# Altium schematic sheet SCH_SA45_DaughterCard.SchDoc: NOT USED
size B; Date: NOT USED; ApprovedBy: NOT USED; CheckedBy: NOT USED; Author: NOT USED; CompanyName: NOT USED; DrawnBy: NOT USED; Engineer: NOT USED; Organization: NOT USED; Address1: NOT USED; Address2: NOT USED; Address3: NOT USED; Address4: NOT USED; DocumentNumber: Use Project Parameter prjSchematic_IPN; Revision: NOT USED; SheetNumber: 1; SheetTotal: 1; sch_PageDescription: Page Description; sch_PageTitle: Page Title; PageDate: NOT USED; Time: NOT USED; DocumentFullPathAndName: NOT USED; DocumentName: NOT USED; ImagePath: NOT USED; ProjectName: NOT USED; Application_BuildNumber: NOT USED
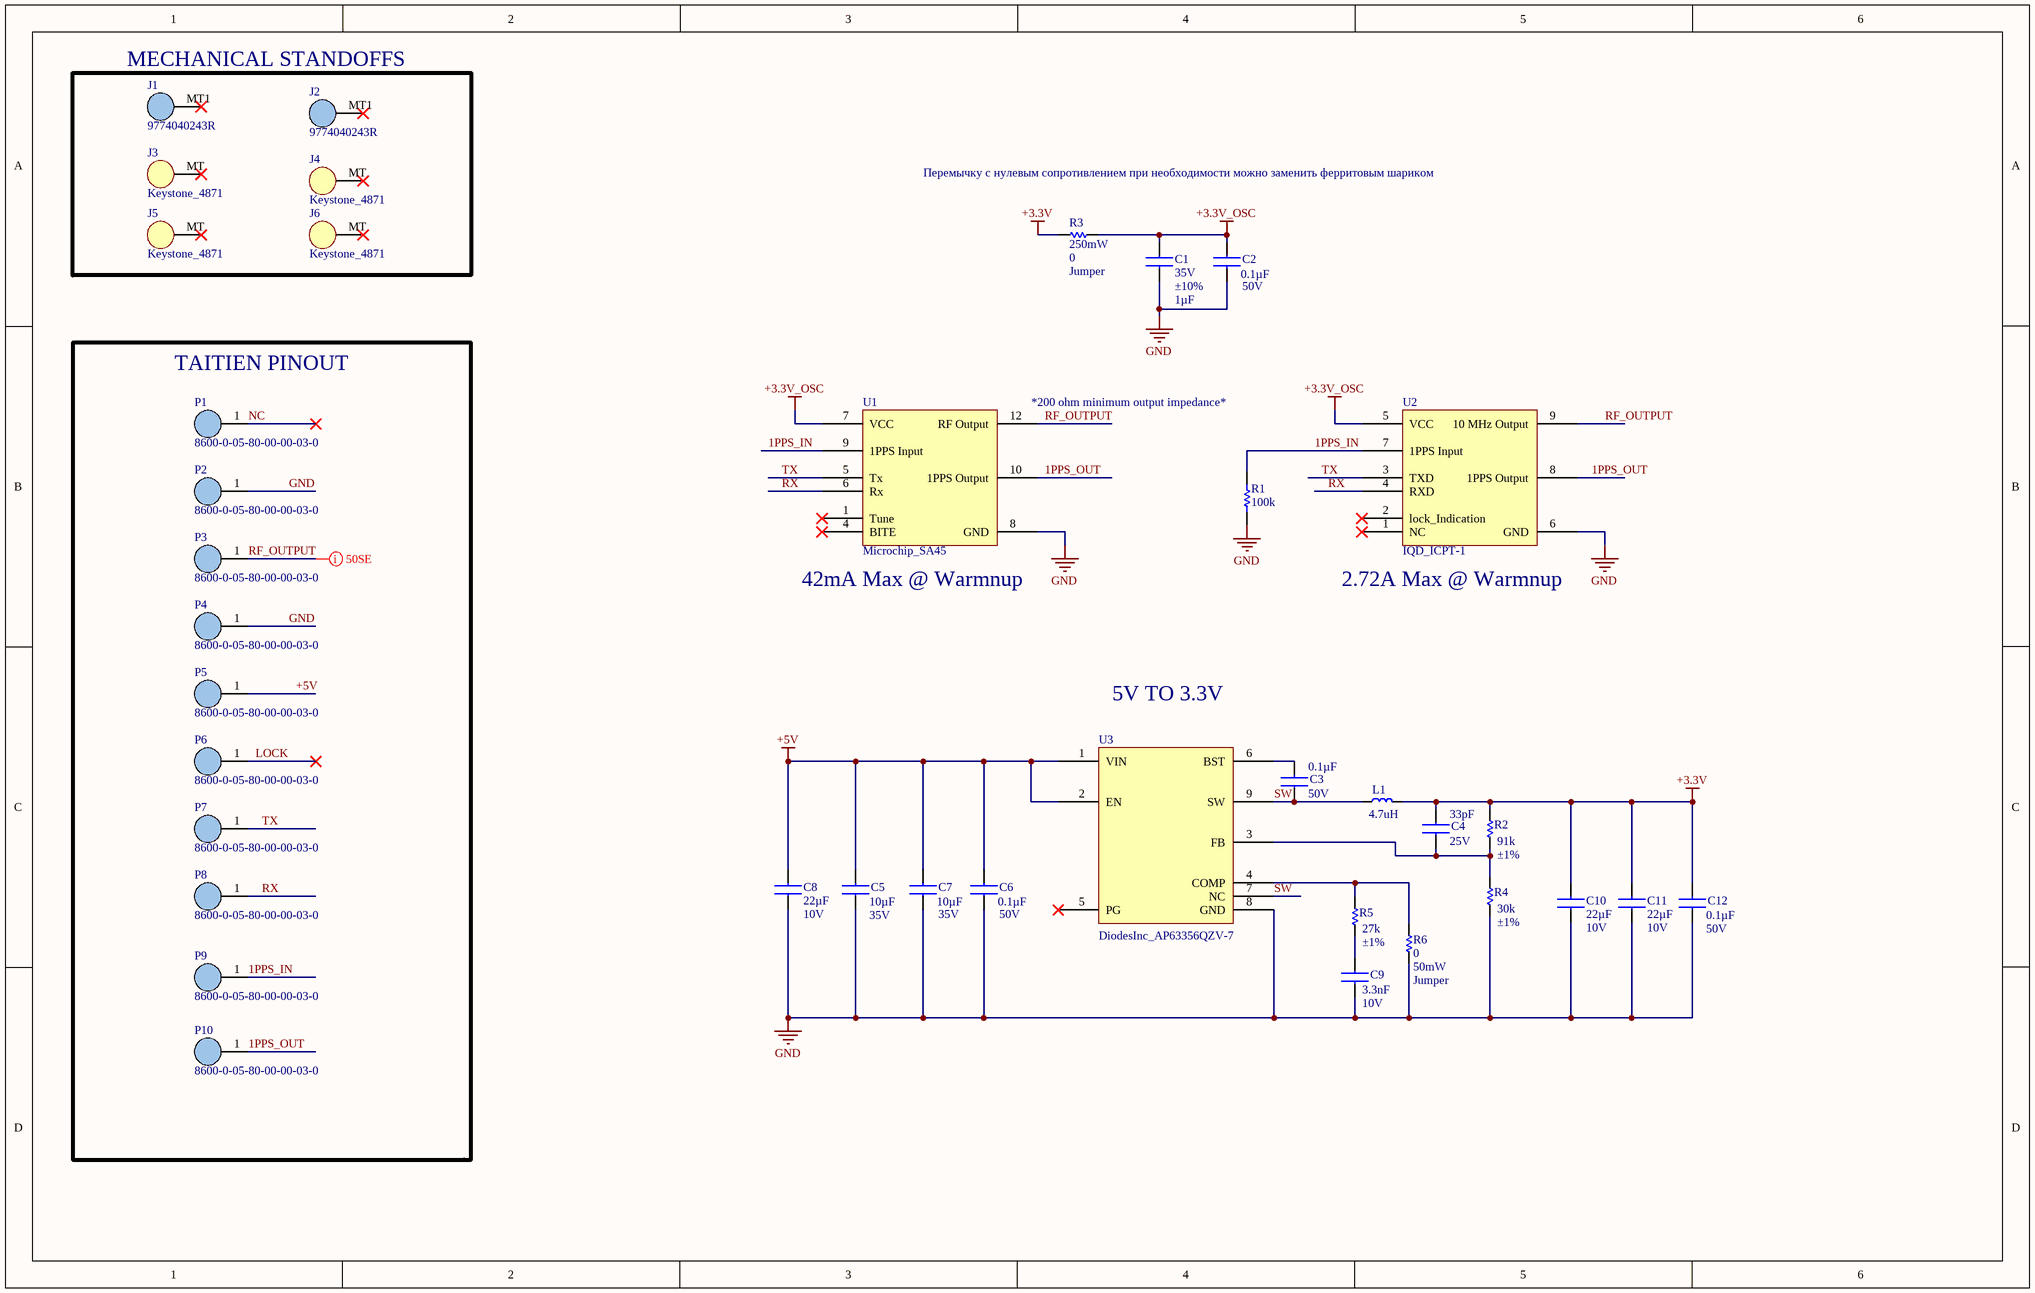
[diagram p0: SCH_SA45_DaughterCard.SchDoc]

## Parts
C1  Voltage Rating: 35V  Tolerance: ±10%  Capacitance: 1µF  [CAPC1005X061N]  (hidden comment: Murata_GRM155R6YA105KE11D)
C2  Voltage Rating: 50V  Capacitance: 0.1µF  [CAPC1005X055N]  (hidden comment: Murata_GRM155R61H104KE14D)
C3  Voltage Rating: 50V  Capacitance: 0.1µF  [CAPC1005X055N]  (hidden comment: Murata_GRM155R61H104KE14D)
C4  Capacitance: 33pF  Voltage Rating: 25V  [CAPC0603X033N]  (hidden comment: Murata_GRM0335C1E330JA01D)
C5  Voltage Rating: 35V  Capacitance: 10µF  [CAPC2013X145N]  (hidden comment: Murata_GRM21BR6YA106KE43L)
C6  Voltage Rating: 50V  Capacitance: 0.1µF  [CAPC1005X055N]  (hidden comment: Murata_GRM155R61H104KE14D)
C7  Voltage Rating: 35V  Capacitance: 10µF  [CAPC2013X145N]  (hidden comment: Murata_GRM21BR6YA106KE43L)
C8  Capacitance: 22µF  Voltage Rating: 10V  [CAPC2013X140N]  (hidden comment: Murata_GRM21BR61A226ME51L)
C9  Capacitance: 3.3nF  Voltage Rating: 10V  [CAPC0603X033N]  (hidden comment: Murata_GRM033R61A332KA01D)
C10  Capacitance: 22µF  Voltage Rating: 10V  [CAPC2013X140N]  (hidden comment: Murata_GRM21BR61A226ME51L)
C11  Capacitance: 22µF  Voltage Rating: 10V  [CAPC2013X140N]  (hidden comment: Murata_GRM21BR61A226ME51L)
C12  Voltage Rating: 50V  Capacitance: 0.1µF  [CAPC1005X055N]  (hidden comment: Murata_GRM155R61H104KE14D)
J1  Manufacturer Part Number: 9774040243R  [TH000V_300DIAx400_001mt_9774040243R]  (hidden comment: Wurth_9774040243R)
J2  Manufacturer Part Number: 9774040243R  [TH000V_300DIAx400_001mt_9774040243R]  (hidden comment: Wurth_9774040243R)
J3  Keystone_4871  [Keystone_4871]
J4  Keystone_4871  [Keystone_4871]
J5  Keystone_4871  [Keystone_4871]
J6  Keystone_4871  [Keystone_4871]
L1  4.7uH  [Eaton_HCM0703-4R7-R]
P1  Manufacturer Part Number: 8600-0-05-80-00-00-03-0  [TH001V_109DIA_000mt_8600-0]  (hidden comment: Mill-Max_8600-0-05-80-00-00-03-0)
P2  Manufacturer Part Number: 8600-0-05-80-00-00-03-0  [TH001V_109DIA_000mt_8600-0]  (hidden comment: Mill-Max_8600-0-05-80-00-00-03-0)
P3  Manufacturer Part Number: 8600-0-05-80-00-00-03-0  [TH001V_109DIA_000mt_8600-0]  (hidden comment: Mill-Max_8600-0-05-80-00-00-03-0)
P4  Manufacturer Part Number: 8600-0-05-80-00-00-03-0  [TH001V_109DIA_000mt_8600-0]  (hidden comment: Mill-Max_8600-0-05-80-00-00-03-0)
P5  Manufacturer Part Number: 8600-0-05-80-00-00-03-0  [TH001V_109DIA_000mt_8600-0]  (hidden comment: Mill-Max_8600-0-05-80-00-00-03-0)
P6  Manufacturer Part Number: 8600-0-05-80-00-00-03-0  [TH001V_109DIA_000mt_8600-0]  (hidden comment: Mill-Max_8600-0-05-80-00-00-03-0)
P7  Manufacturer Part Number: 8600-0-05-80-00-00-03-0  [TH001V_109DIA_000mt_8600-0]  (hidden comment: Mill-Max_8600-0-05-80-00-00-03-0)
P8  Manufacturer Part Number: 8600-0-05-80-00-00-03-0  [TH001V_109DIA_000mt_8600-0]  (hidden comment: Mill-Max_8600-0-05-80-00-00-03-0)
P9  Manufacturer Part Number: 8600-0-05-80-00-00-03-0  [TH001V_109DIA_000mt_8600-0]  (hidden comment: Mill-Max_8600-0-05-80-00-00-03-0)
P10  Manufacturer Part Number: 8600-0-05-80-00-00-03-0  [TH001V_109DIA_000mt_8600-0]  (hidden comment: Mill-Max_8600-0-05-80-00-00-03-0)
R1  100k  [RESC1608X55X30ML15T15]
R2  Tolerance: ±1%  Resistance: 91k  [RESC1005X040N]  (hidden comment: Yageo_RC0402FR-0791KL)
R3  Power (Watts): 250mW  Resistance: 0  Tolerance: Jumper  [RESC3216X070N]  (hidden comment: Yageo_RC1206JR-070RL)
R4  Tolerance: ±1%  Resistance: 30k  [RESC1005X040N]  (hidden comment: Yageo_RC0402FR-0730KL)
R5  Tolerance: ±1%  Resistance: 27k  [RESC1005X040N]  (hidden comment: Panasonic_ERJ-2RKF2702X)
R6  Resistance: 0  Power (Watts): 50mW  Tolerance: Jumper  [RESC0603X026N]  (hidden comment: Yageo_RC0201JR-070RL)
U1  Microchip_SA45  [Microchip_SA45]
U2  IQD_ICPT-1  [IQD_ICPT-1]
U3  DiodesInc_AP63356QZV-7  [DiodesInc_AP63356QZV-7]

## Blocks framed on the sheet
MECHANICAL STANDOFFS: J1-J6
TAITIEN PINOUT: P1-P10

## Nets
+3.3V: C4.1 C10.1 C11.1 C12.1 L1.2 R2.1 R3.1
+3.3V_OSC: C1.1 C2.1 R3.2 U1.7(VCC) U2.5(VCC)
+5V: C5.1 C6.1 C7.1 C8.1 P5.1 U3.1(VIN) U3.2(EN)
GND: C1.2 C2.2 C5.2 C6.2 C7.2 C8.2 C9.2 C10.2 C11.2 C12.2 P2.1 P4.1 R1.1 R4.2 R6.2 U1.8(GND) U2.6(GND) U3.8(GND)
1PPS_IN: P9.1 R1.2 U1.9(1PPS_Input) U2.7(1PPS_Input)
1PPS_OUT: P10.1 U1.10(1PPS_Output) U2.8(1PPS_Output)
LOCK: P6.1
NC: P1.1
RF_OUTPUT: P3.1 U1.12(RF_Output) U2.9(10_MHz_Output)
RX: P8.1 U1.6(Rx) U2.4(RXD)
SW: C3.2 L1.1 U3.7(NC) U3.9(SW)
TX: P7.1 U1.5(Tx) U2.3(TXD)
NetC3_1: C3.1 U3.6(BST)
NetC4_2: C4.2 R2.2 R4.1 U3.3(FB)
NetC9_1: C9.1 R5.2
NetR5_1: R5.1 R6.1 U3.4(COMP)

Not connected (* = marked no-connect by the designer): J1 MT1*; J2 MT1*; J3 MT*; J4 MT*; J5 MT*; J6 MT*; U1 1(Tune)* 4(BITE)*; U2 1(NC)* 2(lock_Indication)*; U3 5(PG)*

## Layout directives
net class 50SE: RF_OUTPUT

## Notes on the sheet
- Перемычку с нулевым сопротивлением при необходимости можно заменить ферритовым шариком
- (near U1) *200 ohm minimum output impedance*
- (near U1) 42mA Max @ Warmnup
- (near U2) 2.72A Max @ Warmnup
- 5V TO 3.3V
- CONFIDENTIALITY NOTICE
- TITLE
- PROJECT
- ENGINEER
- FILENAME
- GENERATED DATE
- DESCRIPTION
- SCHEMATIC NUMBER
- REV
- SHEET
- THIS DOCUMENT IS CONFIDENTIAL AND CONTAINS DESIGNS AND OTHER PROPRIETARY INFORMATION OF META PLATFORMS TECHNOLOGIES, LLC AND ITS AFFILIATES. THIS DOCUMENT AND THE INFORMATION IT CONTAINS MAY NOT BE DUPLICATED, DISCLOSED OR USED, IN WHOLE OR IN PART, FOR ANY PURPOSE (INCLUDING MANUFACTURE OF ANY COMPONENT) WITHOUT THE PRIOR WRITTEN CONSENT OF META PLATFORMS TECHNOLOGIES, LLC.

## Library data of the parts
C1 = CAP-CMP-00372-3: CAP, CER, X5R, 1UF, 10%, 35V, 0402, 0.55MM T; Manufacturer: Murata; Polarization: Non-polar; Case/Package: 0402 (1005 Metric); Mounting Type: Surface Mount, MLCC; Min Operating Temperature: -55°C; Datasheet URL: https://www.digikey.com/en/products/detail/murata-electronics/GRM155R6YA105KE11D/4905162?s=N4IgTCBcDaIOICUCyBGArGhA2AmgQRQAY0BpAURRQBEQBdAXyA; Temperature Coefficient: X5R; RoHS: Yes; Supplier 1: Digikey; Applications: General Purpose; Composition: Ceramic; Max Operating Temperature: 85°C; Height: 0.024" (0.60mm); Manufacturer Part Number: GRM155R6YA105KE11D; Supplier Part Number 1: 490-10019-1-ND; Size / Dimension: 0.039" L x 0.020" W (1.00mm x 0.50mm); Series: GRM155R6YA; Category: Ceramic Capacitors
C2 C3 C6 C12 = CAP-CMP-00369-3: CAP, CER, X5R, 0.10UF, 10%, 50V, 0402, 0.55MM T; Manufacturer: Murata; Polarization: Non-polar; Applications: General Purpose; Supplier Part Number 1: 490-10697-1-ND; Series: GRM155R61H; RoHS: Yes; Mounting Type: Surface Mount, MLCC; Composition: Ceramic; Supplier 1: Digikey; Tolerance: ±10%; Max Operating Temperature: 85°C; Datasheet URL: https://www.digikey.com/en/products/detail/murata-electronics/GRM155R61H104KE14D/4905152?s=N4IgTCBcDaIOICUCyBGArGhA2FAJFADACwDSAoikQCIgC6AvkA; Min Operating Temperature: -55°C; Category: Ceramic Capacitors; Manufacturer Part Number: GRM155R61H104KE14D; Temperature Coefficient: X5R; Case/Package: 0402 (1005 Metric); Size / Dimension: 0.039" L x 0.020" W (1.00mm x 0.50mm); Height: 0.022" (0.55mm)
C4 = CAP-CMP-00129-3: CAP, CER, NP0, 33PF, 5%, 25V, 0201, 0.33MM T; Manufacturer: Murata; Polarization: Non-polar; Temperature Coefficient: C0G, NP0; Applications: General Purpose; RoHS: Yes; Datasheet URL: https://www.digikey.com/en/products/detail/murata-electronics/GRM0335C1E330JA01D/4358214?s=N4IgTCBcDaIOICUCyAGAzGgrAYQIwFEMUApAQRVwBEQBdAXyA; Min Operating Temperature: -55°C; Height: 0.013" (0.33mm); Tolerance: ±5%; Case/Package: 0201 (0603 Metric); Series: GRM0335C1E; Manufacturer Part Number: GRM0335C1E330JA01D; Size / Dimension: 0.024" L x 0.012" W (0.60mm x 0.30mm); Category: Ceramic Capacitors; Max Operating Temperature: 125°C; Composition: Ceramic; Supplier Part Number 1: 490-10678-1-ND; Supplier 1: Digikey; Mounting Type: Surface Mount, MLCC
C5 C7 = CAP-CMP-00525-3: CAP, CER, X5R, 10UF, 10%, 35V, 0805, 1.45MM T; Manufacturer: Murata; Polarization: Non-polar; RoHS: Yes; Series: GRM21BR6YA; Manufacturer Part Number: GRM21BR6YA106KE43L; Tolerance: ±10%; Height: 0.057" (1.45mm); Temperature Coefficient: X5R; Mounting Type: Surface Mount, MLCC; Category: Ceramic Capacitors; Max Operating Temperature: 85°C; Applications: General Purpose; Min Operating Temperature: -55°C; Supplier 1: Digikey; Supplier Part Number 1: 490-10514-1-ND; Size / Dimension: 0.079" L x 0.049" W (2.00mm x 1.25mm); Composition: Ceramic; Case/Package: 0805 (2013 Metric); Datasheet URL: https://www.digikey.com/en/products/detail/murata-electronics/GRM21BR6YA106KE43L/5027598?s=N4IgTCBcDaIOICUCyYCMAhBA2AmgQVQAYsBpAUQBYBmAGRAF0BfIA
C8 C10 C11 = CAP-CMP-00519-3: CAP, CER, X5R, 22UF, 20%, 10V, 0805, 1.40MM T; Manufacturer: Murata; Polarization: Non-polar; Category: Ceramic Capacitors; Mounting Type: Surface Mount, MLCC; Case/Package: 0805 (2013 Metric); RoHS: Yes; Height: 0.055" (1.40mm); Supplier 1: Digikey; Supplier Part Number 1: 490-10511-1-ND; Size / Dimension: 0.079" L x 0.049" W (2.00mm x 1.25mm); Min Operating Temperature: -55°C; Datasheet URL: https://www.digikey.com/en/products/detail/murata-electronics/GRM21BR61A226ME51L/5027595?s=N4IgTCBcDaIOICUCyYCMAhBA2VBBMYWSAogKyoAyIAugL5A; Manufacturer Part Number: GRM21BR61A226ME51L; Series: GRM21BR61A; Applications: General Purpose; Composition: Ceramic; Tolerance: ±20%; Temperature Coefficient: X5R; Max Operating Temperature: 85°C
C9 = CAP-CMP-00202-3: CAP, CER, X5R, 3300PF, 10%, 10V, 0201, 0.33MM T; Manufacturer: Murata; Polarization: Non-polar; Tolerance: ±10%; Min Operating Temperature: -55°C; RoHS: Yes; Manufacturer Part Number: GRM033R61A332KA01D; Datasheet URL: https://www.digikey.com/en/products/detail/murata-electronics/GRM033R61A332KA01D/702429?s=N4IgTCBcDaIOICUCyAGAzGhA2AjAQQzAGk8UcAREAXQF8g; Supplier 1: Digikey; Max Operating Temperature: 85°C; Applications: General Purpose; Supplier Part Number 1: 490-3163-1-ND; Case/Package: 0201 (0603 Metric); Composition: Ceramic; Temperature Coefficient: X5R; Series: GRM; Height: 0.013" (0.33mm); Size / Dimension: 0.024" L x 0.012" W (0.60mm x 0.30mm)
J1 J2 = CON-CMP-00164-1: STANDOFF, ROUND, M2X0.4 STEEL 4MM, 9774040243R; Manufacturer: Wurth Elektronik; System: connector; Screw Thread: M2x0.4; Min Operating Temperature: -55°C; Series: WA-SMSI; Max Operating Temperature: 150°C; Type: Round Standoff; Mounting Type: Through Hole, Vertical; Supplier 1: Digikey; Supplier Part Number 1: 732-7090-1-ND; Height: 0.157" (4.00mm); RoHS: Yes; Contact Material: Steel; Category: Board Spacers, Standoffs; Datasheet URL: https://www.digikey.com/en/products/detail/w%C3%BCrth-elektronik/9774040243R/5320633?s=N4IgTCBcDaIJwHYEBYAMazIMwCUQF0BfIA
J3-J6 = Keystone_4871: Manufacturer: Keystone Electronics; Manufacturer Part Number: 4871; System: connector; Supplier 1: *; Supplier Part Number 1: *; ComponentLink1Description: Datasheet; ComponentLink1URL: *
L1 = Inductor_Eaton: Manufacturer: Eaton; Manufacturer Part Number: HCM0703-4R7-R
P1-P10 = CON-CMP-00162-1: CONN, PC PIN, PRESS-FIT, 10.16MM LENGTH, TIN, TH; Manufacturer: Mill-Max Manufacturing Corp.; Flange Diameter: 0.072" (1.83mm); System: connector; Pin Size - Above Flange: 0.040" (1.02mm) Dia; Mounting Hole Diameter: 0.043" (1.09mm); Rows: 1; Insulation: Non-Insulated; Pin Size - Below Flange: 0.035" (0.89mm) Square; Contact Material: Brass Alloy; Terminal Type: PC Pin; Length - Below Flange: 0.060" (1.52mm); Supplier Part Number 1: 8600-0-05-80-00-00-03-0-ND; Length - Overall: 0.460" (11.68mm); Min Operating Temperature: -55°C; Series: 8600; Max Operating Temperature: 125°C; Length - Above Flange: 0.364" (9.25mm); Contact Finish: Tin; Termination: Press-Fit, Square; Mounting Type: Through Hole, Vertical; RoHS: Yes; Category: Terminals - PC Pin, Single Post Connectors; Terminal Style: Single End; Supplier 1: Digikey; Datasheet URL: https://www.digikey.com/en/products/detail/mill-max-manufacturing-corp/8600-0-05-80-00-00-03-0/7775333?s=N4IgTCBcDaIBwDYAMSC0akFZVw39AzOiALoC%2BQA; Signal Pins: 1
R1 = CMP-2000-00182-1: Manufacturer: Panasonic; Manufacturer Part Number: ERJ-3EKF1003V
R2 = RES-CMP-00859-1: RES SMD 91K OHM 1% 1/16W 0402; Manufacturer: Yageo; Temperature Coefficient: ±100ppm/°C; Power (Watts): 62.5mW; Supplier Part Number 1: 311-91.0KLRCT-ND; Category: Chip Resistor - Surface Mount; Max Operating Temperature: 155°C; Composition: Thick Film; Height: 0.016" (0.40mm); Manufacturer Part Number: RC0402FR-0791KL; Series: RC_L; Min Operating Temperature: -55°C; Datasheet URL: https://www.yageo.com/upload/media/product/productsearch/datasheet/rchip/PYu-RC_Group_51_RoHS_L_12.pdf; Case/Package: 0402 (1005 Metric); Supplier 1: Digi-Key; Size / Dimension: 0.039" L x 0.020" W (1.00mm x 0.50mm)
R3 = RES-CMP-00805-3: RES, 0 OHM, 2A, 1/4W, 1206; Manufacturer: Yageo; Height: 0.026" (0.65mm); Supplier Part Number 1: 311-0.0ERCT-ND; Supplier 1: Digikey; Features: Moisture Resistant; Datasheet URL: https://www.digikey.com/en/products/detail/yageo/RC1206JR-070RL/729184?s=N4IgTCBcDaIEoGECMYAMA2AUnAtKg7KnADIgC6AvkA; Category: Chip Resistor - Surface Mount; Manufacturer Part Number: RC1206JR-070RL; Series: RC_L; RoHS: Yes; Max Operating Temperature: 155°C; Case/Package: 1206 (3216 Metric); Min Operating Temperature: -55°C; Size / Dimension: 0.122" L x 0.063" W (3.10mm x 1.60mm); Composition: Thick Film
R4 = RES-CMP-00517-3: RES SMD 30K OHM 1% 1/16W 0402; Manufacturer: Yageo; Temperature Coefficient: ±100ppm/°C; Power (Watts): 62.5mW; Category: Chip Resistor - Surface Mount; Height: 0.016" (0.40mm); Supplier 1: Digi-Key; Series: RC_L; Min Operating Temperature: -55°C; Max Operating Temperature: 155°C; Supplier Part Number 1: 311-30.0KLRCT-ND; Manufacturer Part Number: RC0402FR-0730KL; Composition: Thick Film; Case/Package: 0402 (1005 Metric); Datasheet URL: https://www.yageo.com/upload/media/product/productsearch/datasheet/rchip/PYu-RC_Group_51_RoHS_L_11.pdf; Size / Dimension: 0.039" L x 0.020" W (1.00mm x 0.50mm)
R5 = RES-CMP-00346-3: RES, 27K OHM, 1%, 1/10W, 100PPM/C, 0402; Power (Watts): 100mW; Temperature Coefficient: ±100ppm/°C; Composition: Thick Film; Category: Chip Resistor - Surface Mount; Case/Package: 0402 (1005 Metric); Features: Automotive AEC-Q200; Min Operating Temperature: -55°C; Manufacturer: Panasonic; Supplier Part Number 1: P27.0KLCT-ND; Max Operating Temperature: 155°C; Ratings: AEC-Q200; Datasheet URL: https://www.digikey.com/en/products/detail/panasonic-electronic-components/ERJ-2RKF2702X/1746175?s=N4IgTCBcDaIKICUBSBaMCDSAxMB2ADGABogC6AvkA; Series: ERJ-2RK; RoHS: Yes; Size / Dimension: 0.039" L x 0.020" W (1.00mm x 0.50mm); Manufacturer Part Number: ERJ-2RKF2702X; Height: 0.016" (0.40mm); Supplier 1: Digikey
R6 = RES-CMP-00042-3: RES, 0.0 OHM, 0.5A, 1/20W, 0201; Manufacturer: Yageo; Manufacturer Part Number: RC0201JR-070RL; Datasheet URL: https://www.yageo.com/upload/media/product/productsearch/datasheet/rchip/PYu-RC_Group_51_RoHS_L_11.pdf; Case/Package: 0201 (0603 Metric); Supplier Part Number 1: 311-0.0NCT-ND; Series: RC; Height: 0.010" (0.26mm); Composition: Thick Film; Supplier 1: Digi-Key; Size / Dimension: 0.024" L x 0.012" W (0.60mm x 0.30mm); Category: Chip Resistor - Surface Mount
U1 = Microchip_SA45: Manufacturer Part Number: 090-02984-001; System: connector; Manufacturer: Microchip; Supplier 1: *; Supplier Part Number 1: *; ComponentLink1Description: Datasheet; ComponentLink1URL: *
U2 = IQD_ICPT-1: Manufacturer: IQD; Manufacturer Part Number: IQD-ICPT-1; Supplier 1: *; Supplier Part Number 1: *; ComponentLink1Description: Datasheet; ComponentLink1URL: *
U3 = DiodesInc_AP63356QZV-7: Manufacturer: Diodes Incorporated; System: connector; Manufacturer Part Number: AP63356QZV-7; Supplier 1: *; Supplier Part Number 1: *; ComponentLink1Description: Datasheet; ComponentLink1URL: *